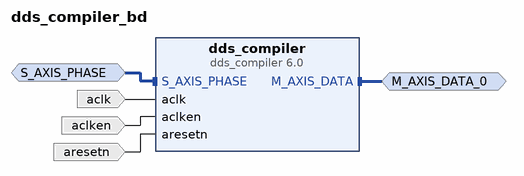
[diagram p0: block diagram of the top level]
# Vivado block design dds_compiler_bd, xc7z010clg400-1, Vivado 2019.2
create_bd_design dds_compiler_bd

create_bd_intf_port -mode Master -vlnv xilinx.com:interface:axis_rtl:1.0 M_AXIS_DATA_0
set_property -dict [list \
  CONFIG.FREQ_HZ 125000000 \
  CONFIG.CLK_DOMAIN generator_processing_system7_0_0_FCLK_CLK0 \
] [get_bd_intf_ports M_AXIS_DATA_0]
create_bd_intf_port -mode Slave -vlnv xilinx.com:interface:axis_rtl:1.0 S_AXIS_PHASE
set_property -dict [list \
  CONFIG.TDATA_NUM_BYTES 9 \
  CONFIG.TDEST_WIDTH 0 \
  CONFIG.TID_WIDTH 0 \
  CONFIG.TUSER_WIDTH 0 \
  CONFIG.HAS_TREADY 0 \
  CONFIG.HAS_TSTRB 0 \
  CONFIG.HAS_TKEEP 0 \
  CONFIG.HAS_TLAST 0 \
  CONFIG.FREQ_HZ 125000000 \
  CONFIG.CLK_DOMAIN generator_processing_system7_0_0_FCLK_CLK0 \
  CONFIG.LAYERED_METADATA undef \
] [get_bd_intf_ports S_AXIS_PHASE]
create_bd_port -dir I -type clk aclk
set_property -dict {CONFIG.CLK_DOMAIN generator_processing_system7_0_0_FCLK_CLK0 CONFIG.FREQ_HZ 125000000} [get_bd_ports aclk]
create_bd_port -dir I -type ce aclken
set_property -dict {CONFIG.POLARITY ACTIVE_HIGH} [get_bd_ports aclken]
create_bd_port -dir I -type rst aresetn

create_bd_cell -type ip -vlnv xilinx.com:ip:dds_compiler:6.0 dds_compiler
set_property -dict [list \
  CONFIG.DATA_Has_TLAST Not_Required \
  CONFIG.DDS_Clock_Rate 125 \
  CONFIG.Has_ACLKEN true \
  CONFIG.Has_ARESETn true \
  CONFIG.Has_Phase_Out false \
  CONFIG.Has_TREADY true \
  CONFIG.Latency 14 \
  CONFIG.M_DATA_Has_TUSER Not_Required \
  CONFIG.Negative_Sine true \
  CONFIG.Noise_Shaping None \
  CONFIG.Output_Frequency1 0 \
  CONFIG.Output_Width 14 \
  CONFIG.PINC1 0 \
  CONFIG.Parameter_Entry Hardware_Parameters \
  CONFIG.Phase_Increment Streaming \
  CONFIG.Phase_Width 30 \
  CONFIG.Phase_offset Streaming \
  CONFIG.Resync true \
  CONFIG.S_PHASE_Has_TUSER Not_Required \
] [get_bd_cells dds_compiler]

# ---- connections ----

connect_bd_intf_net [get_bd_intf_ports S_AXIS_PHASE] [get_bd_intf_pins dds_compiler/S_AXIS_PHASE]
connect_bd_intf_net [get_bd_intf_ports M_AXIS_DATA_0] [get_bd_intf_pins dds_compiler/M_AXIS_DATA]
connect_bd_net [get_bd_ports aclk] [get_bd_pins dds_compiler/aclk]
connect_bd_net [get_bd_ports aclken] [get_bd_pins dds_compiler/aclken]
connect_bd_net [get_bd_ports aresetn] [get_bd_pins dds_compiler/aresetn]

validate_bd_design
save_bd_design
